# Altium project ui-v1.2.PrjPcb
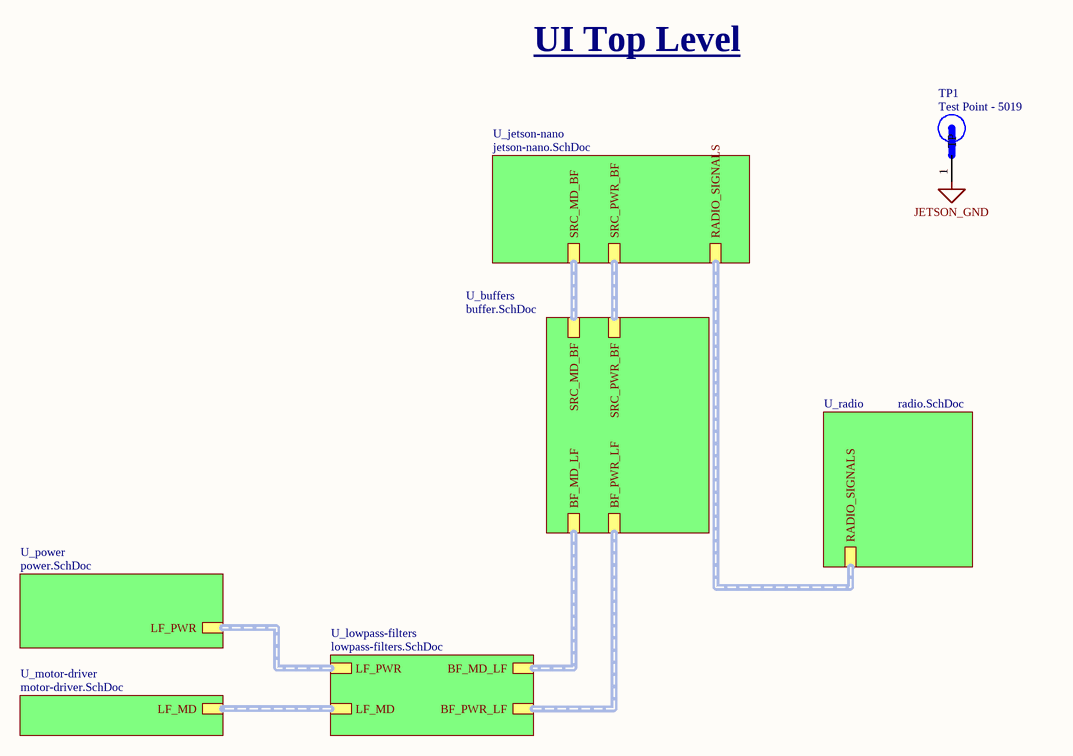
[diagram p0: ui-pcb.SchDoc]
7 sheets, 72 parts. Net scope: hierarchical (ports join the sheet entries above them; power ports are global).
Board file: ui_layout-v1.2.PcbDoc
Sheets:
  ui-pcb.SchDoc
    U_jetson-nano = jetson-nano.SchDoc
    U_lowpass-filters = lowpass-filters.SchDoc
    U_motor-driver = motor-driver.SchDoc
    U_power = power.SchDoc
    U_buffers = buffer.SchDoc
    U_radio = radio.SchDoc

## Sheet ui-pcb.SchDoc
size A4; SheetNumber: 1; SheetTotal: 8

### Parts
TP1  Test Point - 5019  [TP380X203]

### Sub-sheets
U_buffers = buffer.SchDoc: SRC_MD_BF (harness MD_SIGNALS), SRC_PWR_BF (harness PWR_SIGNALS), BF_MD_LF (harness MD_SIGNALS), BF_PWR_LF (harness PWR_SIGNALS)
U_jetson-nano = jetson-nano.SchDoc: SRC_PWR_BF (harness PWR_SIGNALS), SRC_MD_BF (harness MD_SIGNALS), RADIO_SIGNALS (harness RADIO_SIGNALS)
U_lowpass-filters = lowpass-filters.SchDoc: BF_PWR_LF (harness PWR_SIGNALS), LF_PWR (harness PWR_SIGNALS), BF_MD_LF (harness MD_SIGNALS), LF_MD (harness MD_SIGNALS)
U_motor-driver = motor-driver.SchDoc: LF_MD (harness MD_SIGNALS)
U_power = power.SchDoc: LF_PWR (harness PWR_SIGNALS)
U_radio = radio.SchDoc: RADIO_SIGNALS (harness RADIO_SIGNALS)

### Nets
JETSON_GND: TP1.1(TP)

### Buses and harness runs
harness sheet U_buffers/BF_MD_LF = sheet U_lowpass-filters/BF_MD_LF
harness sheet U_buffers/BF_PWR_LF = sheet U_lowpass-filters/BF_PWR_LF
harness sheet U_buffers/SRC_MD_BF = sheet U_jetson-nano/SRC_MD_BF
harness sheet U_buffers/SRC_PWR_BF = sheet U_jetson-nano/SRC_PWR_BF
harness sheet U_jetson-nano/RADIO_SIGNALS = sheet U_radio/RADIO_SIGNALS
harness sheet U_lowpass-filters/LF_MD = sheet U_motor-driver/LF_MD
harness sheet U_lowpass-filters/LF_PWR = sheet U_power/LF_PWR

### Notes on the sheet
- UI Top Level

### Library data of the parts
TP1 = Test Point - 5019: PC Test Point, Miniature Phosphor Bronze, Silver Plating Surface Mount Mounting Type; MP: 5019; MF: Keystone Electronics; Value: *; Package: 2010 Keystone; Part Number: Test Point - 5019

## Sheet jetson-nano.SchDoc
size A3
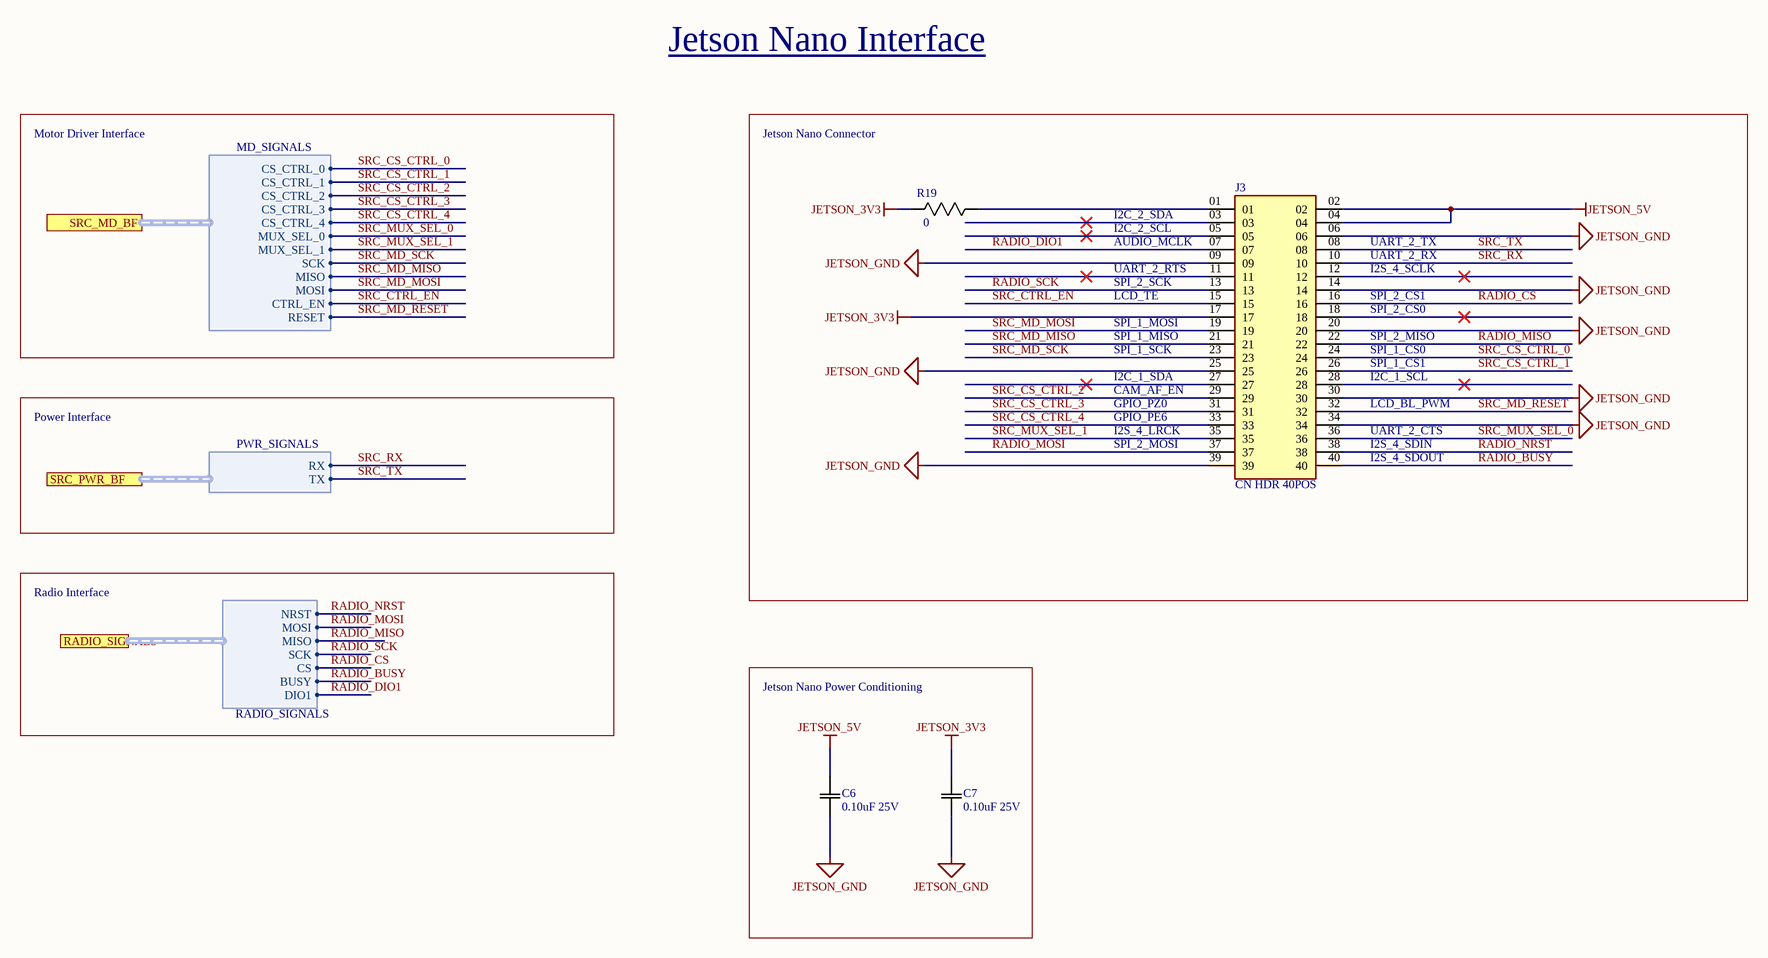
[diagram p1: jetson-nano.SchDoc]

### Parts
C6  0.10uF 25V  [0805]
C7  0.10uF 25V  [0805]
J3  CN HDR 40POS  [CN HDR 40POS 0.1 TH]
R19  0  [0603]

### Blocks framed on the sheet
Jetson Nano Power Conditioning: C6 C7

### Ports
RADIO_SIGNALS (harness RADIO_SIGNALS), SRC_MD_BF (harness MD_SIGNALS), SRC_PWR_BF (harness PWR_SIGNALS)

### Harnesses
PWR_SIGNALS: TX, RX
MD_SIGNALS: CS_CTRL_0, MUX_SEL_1, SCK, MOSI, MISO, CS_CTRL_1, CS_CTRL_2, CS_CTRL_3, CS_CTRL_4, MUX_SEL_0, CTRL_EN, RESET
RADIO_SIGNALS: CS, SCK, MISO, MOSI, NRST, BUSY, DIO1

### Nets
JETSON_3V3: C7.2(C2) J3.17 R19.2(R2)
JETSON_5V: C6.2(C2) J3.02 J3.04
JETSON_GND: C6.1(C1) C7.1(C1) J3.06 J3.09 J3.14 J3.20 J3.25 J3.30 J3.34 J3.39
RADIO_BUSY: J3.40 ; port RADIO_SIGNALS.BUSY
RADIO_CS: J3.16 ; port RADIO_SIGNALS.CS
RADIO_DIO1: J3.07 ; port RADIO_SIGNALS.DIO1
RADIO_MISO: J3.22 ; port RADIO_SIGNALS.MISO
RADIO_MOSI: J3.37 ; port RADIO_SIGNALS.MOSI
RADIO_NRST: J3.38 ; port RADIO_SIGNALS.NRST
RADIO_SCK: J3.13 ; port RADIO_SIGNALS.SCK
SRC_CS_CTRL_0: J3.24 ; port SRC_MD_BF.CS_CTRL_0
SRC_CS_CTRL_1: J3.26 ; port SRC_MD_BF.CS_CTRL_1
SRC_CS_CTRL_2: J3.29 ; port SRC_MD_BF.CS_CTRL_2
SRC_CS_CTRL_3: J3.31 ; port SRC_MD_BF.CS_CTRL_3
SRC_CS_CTRL_4: J3.33 ; port SRC_MD_BF.CS_CTRL_4
SRC_CTRL_EN: J3.15 ; port SRC_MD_BF.CTRL_EN
SRC_MD_MISO: J3.21 ; port SRC_MD_BF.MISO
SRC_MD_MOSI: J3.19 ; port SRC_MD_BF.MOSI
SRC_MD_RESET: J3.32 ; port SRC_MD_BF.RESET
SRC_MD_SCK: J3.23 ; port SRC_MD_BF.SCK
SRC_MUX_SEL_0: J3.36 ; port SRC_MD_BF.MUX_SEL_0
SRC_MUX_SEL_1: J3.35 ; port SRC_MD_BF.MUX_SEL_1
SRC_RX: J3.10 ; port SRC_PWR_BF.RX
SRC_TX: J3.08 ; port SRC_PWR_BF.TX
NetJ3_01: J3.01 R19.1(R1)

Not connected (* = marked no-connect by the designer): J3 03* 05* 11* 12* 18* 27* 28*

### Notes on the sheet
- Jetson Nano Interface
- Motor Driver Interface
- Jetson Nano Connector
- AUDIO_MCLK
- UART_2_RTS
- I2C_2_SDA
- I2C_2_SCL
- I2S_4_SCLK
- UART_2_TX
- UART_2_RX
- LCD_TE
- SPI_2_SCK
- SPI_1_MOSI
- SPI_1_MISO
- SPI_2_CS1
- SPI_2_MISO
- SPI_2_CS0
- GPIO_PZ0
- CAM_AF_EN
- SPI_1_SCK
- I2C_1_SDA
- LCD_BL_PWM
- SPI_1_CS0
- SPI_1_CS1
- I2C_1_SCL
- Power Interface
- SPI_2_MOSI
- I2S_4_LRCK
- GPIO_PE6
- I2S_4_SDIN
- UART_2_CTS
- I2S_4_SDOUT
- Radio Interface

### Library data of the parts
C6 C7 = CAP 0.10uF 25V: CAP CER 0.10UF 25V X7R 0805; Value: 0.1uF; Tolerance: 10%; Temperature Coefficient: X7R; Rating: 25V; Part Number: CAP 0.10uF 25V; Operating Temperature: -55°C ~ 125°C
J3 = CN HDR 40POS: 40 Position Header Connector; Part Number: CN HDR 40POS; Supplier 1: Digi-Key; Supplier Part Number 1: S6104-ND; Supplier URL 1: https://www.digikey.ca/en/products/detail/sullins-connector-solutions/PPTC202LFBN-RC/807240?s=N4IgTCBcDaIMoDYCMAGALAWgHIBEQF0BfIA; Pin Count: 40
R19 = RES 0 JUMPER 0603: Default Resistor Symbol; Power (Watts): 0.125W; Package: 0805; Tolerance: N/A; Value: 0; Part Number: RES 0 JUMPER 0603

## Sheet lowpass-filters.SchDoc
size A3; SheetNumber: 1; SheetTotal: 6
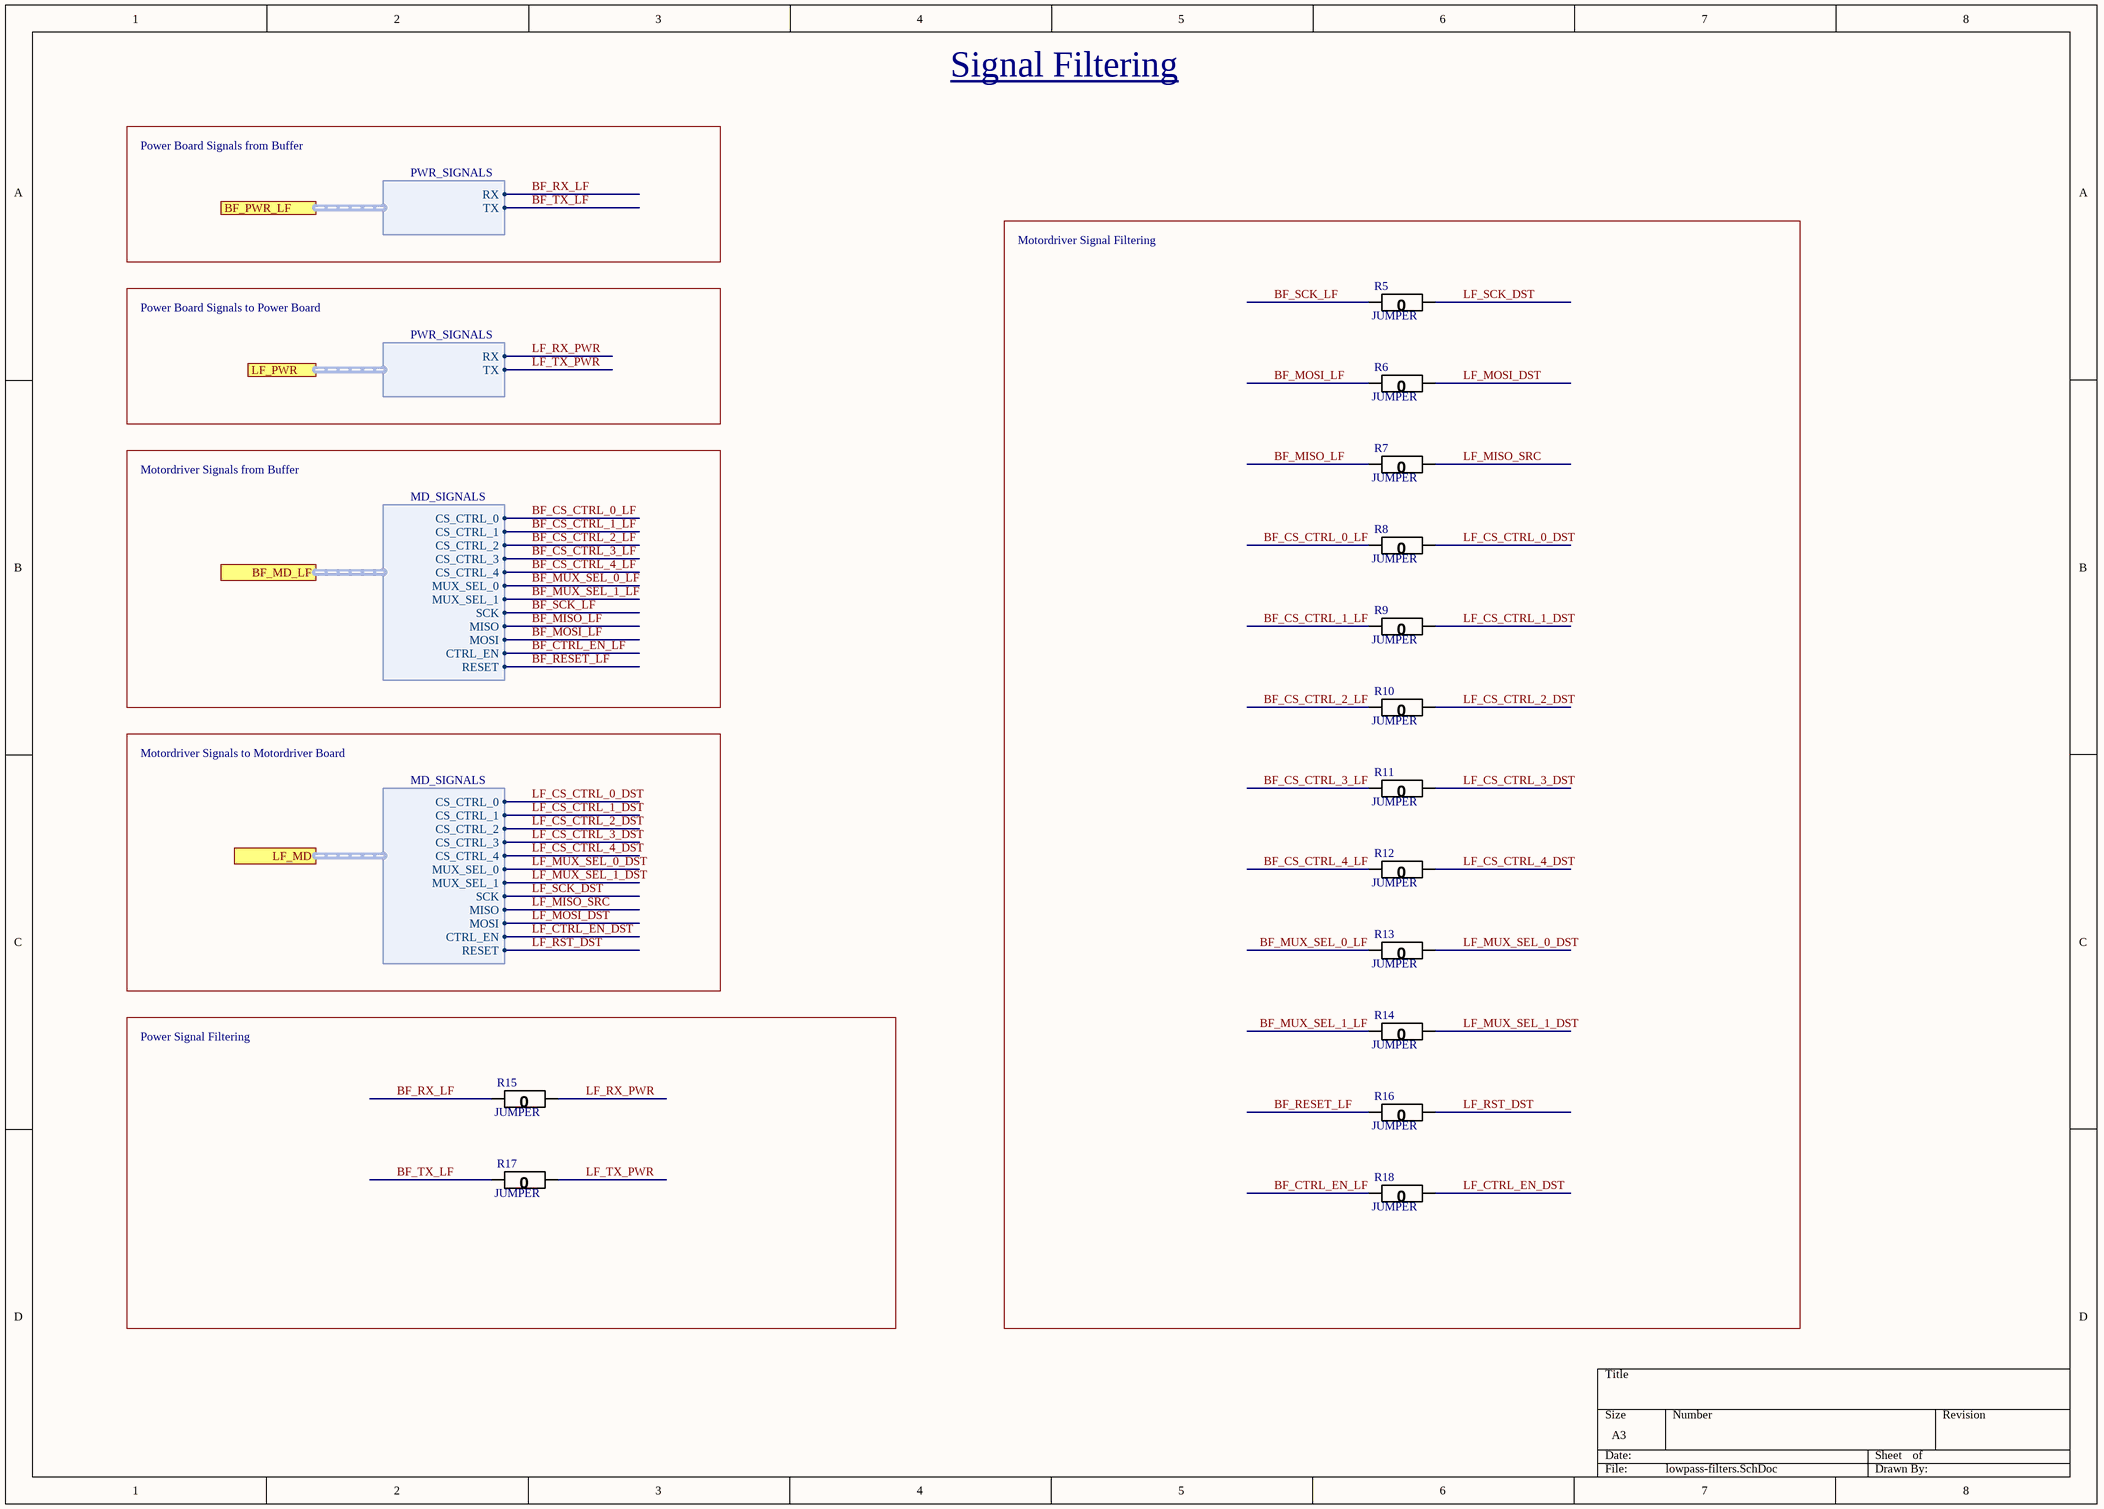
[diagram p2: lowpass-filters.SchDoc]

### Parts
R5  JUMPER  [0603]
R6  JUMPER  [0603]
R7  JUMPER  [0603]
R8  JUMPER  [0603]
R9  JUMPER  [0603]
R10  JUMPER  [0603]
R11  JUMPER  [0603]
R12  JUMPER  [0603]
R13  JUMPER  [0603]
R14  JUMPER  [0603]
R15  JUMPER  [0603]
R16  JUMPER  [0603]
R17  JUMPER  [0603]
R18  JUMPER  [0603]

### Blocks framed on the sheet
Motordriver Signal Filtering: R5-R14 R16 R18
Power Signal Filtering: R15 R17

### Ports
BF_MD_LF (harness MD_SIGNALS), BF_PWR_LF (harness PWR_SIGNALS), LF_MD (harness MD_SIGNALS), LF_PWR (harness PWR_SIGNALS)

### Harnesses
PWR_SIGNALS: TX, RX
MD_SIGNALS: CS_CTRL_0, MUX_SEL_1, SCK, MOSI, MISO, CS_CTRL_1, CS_CTRL_2, CS_CTRL_3, CS_CTRL_4, MUX_SEL_0, CTRL_EN, RESET

### Nets
BF_CS_CTRL_0_LF: R8.2(R2) ; port BF_MD_LF.CS_CTRL_0  [project net BF_CS_CTRL_0]
BF_CS_CTRL_1_LF: R9.2(R2) ; port BF_MD_LF.CS_CTRL_1  [project net BF_CS_CTRL_1]
BF_CS_CTRL_2_LF: R10.2(R2) ; port BF_MD_LF.CS_CTRL_2  [project net BF_CS_CTRL_2]
BF_CS_CTRL_3_LF: R11.2(R2) ; port BF_MD_LF.CS_CTRL_3  [project net BF_CS_CTRL_3]
BF_CS_CTRL_4_LF: R12.2(R2) ; port BF_MD_LF.CS_CTRL_4  [project net BF_CS_CTRL_4]
BF_CTRL_EN_LF: R18.2(R2) ; port BF_MD_LF.CTRL_EN  [project net BF_CTRL_EN]
BF_MISO_LF: R7.2(R2) ; port BF_MD_LF.MISO  [project net BF_MISO]
BF_MOSI_LF: R6.2(R2) ; port BF_MD_LF.MOSI  [project net BF_MOSI]
BF_MUX_SEL_0_LF: R13.2(R2) ; port BF_MD_LF.MUX_SEL_0  [project net BF_MUX_SEL_0]
BF_MUX_SEL_1_LF: R14.2(R2) ; port BF_MD_LF.MUX_SEL_1  [project net BF_MUX_SEL_1]
BF_RESET_LF: R16.2(R2) ; port BF_MD_LF.RESET  [project net BF_RESET]
BF_RX_LF: R15.2(R2) ; port BF_PWR_LF.RX  [project net BF_RX]
BF_SCK_LF: R5.2(R2) ; port BF_MD_LF.SCK  [project net BF_SCK]
BF_TX_LF: R17.2(R2) ; port BF_PWR_LF.TX  [project net BF_TX]
LF_CS_CTRL_0_DST: R8.1(R1) ; port LF_MD.CS_CTRL_0  [project net CS_CTRL_0]
LF_CS_CTRL_1_DST: R9.1(R1) ; port LF_MD.CS_CTRL_1  [project net CS_CTRL_1]
LF_CS_CTRL_2_DST: R10.1(R1) ; port LF_MD.CS_CTRL_2  [project net CS_CTRL_2]
LF_CS_CTRL_3_DST: R11.1(R1) ; port LF_MD.CS_CTRL_3  [project net CS_CTRL_3]
LF_CS_CTRL_4_DST: R12.1(R1) ; port LF_MD.CS_CTRL_4  [project net CS_CTRL_4]
LF_CTRL_EN_DST: R18.1(R1) ; port LF_MD.CTRL_EN  [project net CTRL_EN]
LF_MISO_SRC: R7.1(R1) ; port LF_MD.MISO
LF_MOSI_DST: R6.1(R1) ; port LF_MD.MOSI
LF_MUX_SEL_0_DST: R13.1(R1) ; port LF_MD.MUX_SEL_0
LF_MUX_SEL_1_DST: R14.1(R1) ; port LF_MD.MUX_SEL_1
LF_RST_DST: R16.1(R1) ; port LF_MD.RESET
LF_RX_PWR: R15.1(R1) ; port LF_PWR.RX
LF_SCK_DST: R5.1(R1) ; port LF_MD.SCK
LF_TX_PWR: R17.1(R1) ; port LF_PWR.TX

### Notes on the sheet
- Signal Filtering
- Power Board Signals from Buffer
- Power Board Signals to Power Board
- Motordriver Signals from Buffer
- Motordriver Signals to Motordriver Board

### Library data of the parts
R5-R18 = RES 0 JUMPER: RES SMD 0 OHM JUMPER GENERIC 0603; Manufacturer Part Number 1: RK73Z1JTTD; Value: 0; Package: 0805; Part Number: RES 0 JUMPER; Tolerance: N/A; Supplier 1: Digi-Key; Supplier Part Number 1: 2019-RK73Z1JTTDCT-ND; Supplier URL 1: https://www.digikey.ca/en/products/detail/koa-speer-electronics-inc/RK73Z1JTTD/9845478

## Sheet motor-driver.SchDoc
size A
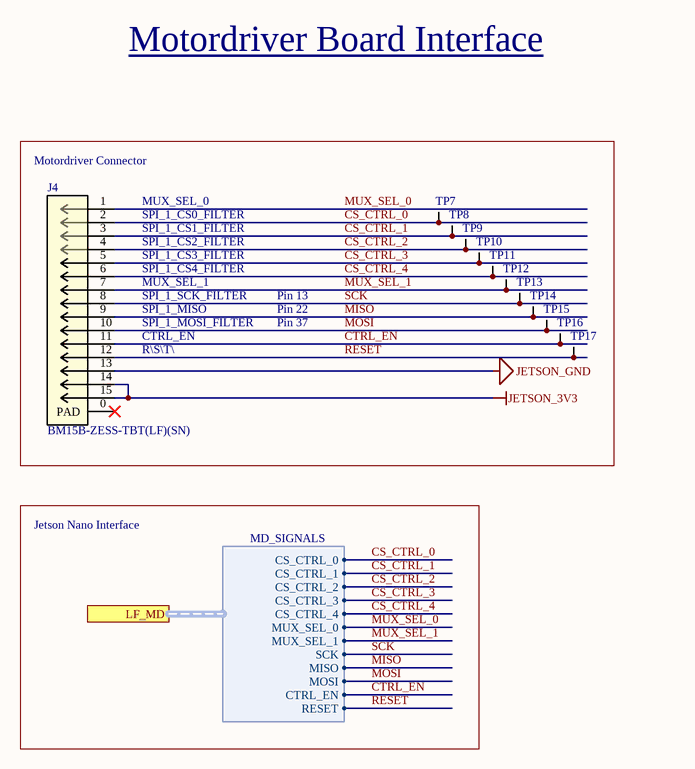
[diagram p3: motor-driver.SchDoc]

### Parts
J4  BM15B-ZESS-TBT(LF)(SN)  [JST ZE SMT 15POS]
TP7  Test Point (Via)  [TP]  (value not drawn)  (no BOM)
TP8  Test Point (Via)  [TP]  (value not drawn)  (no BOM)
TP9  Test Point (Via)  [TP]  (value not drawn)  (no BOM)
TP10  Test Point (Via)  [TP]  (value not drawn)  (no BOM)
TP11  Test Point (Via)  [TP]  (value not drawn)  (no BOM)
TP12  Test Point (Via)  [TP]  (value not drawn)  (no BOM)
TP13  Test Point (Via)  [TP]  (value not drawn)  (no BOM)
TP14  Test Point (Via)  [TP]  (value not drawn)  (no BOM)
TP15  Test Point (Via)  [TP]  (value not drawn)  (no BOM)
TP16  Test Point (Via)  [TP]  (value not drawn)  (no BOM)
TP17  Test Point (Via)  [TP]  (value not drawn)  (no BOM)

### Ports
LF_MD (harness MD_SIGNALS)

### Harnesses
MD_SIGNALS: CS_CTRL_0, MUX_SEL_1, SCK, MOSI, MISO, CS_CTRL_1, CS_CTRL_2, CS_CTRL_3, CS_CTRL_4, MUX_SEL_0, CTRL_EN, RESET

### Nets
JETSON_3V3: J4.14 J4.15
JETSON_GND: J4.13
CS_CTRL_0: J4.2 TP7.1 ; port LF_MD.CS_CTRL_0
CS_CTRL_1: J4.3 TP8.1 ; port LF_MD.CS_CTRL_1
CS_CTRL_2: J4.4 TP9.1 ; port LF_MD.CS_CTRL_2
CS_CTRL_3: J4.5 TP10.1 ; port LF_MD.CS_CTRL_3
CS_CTRL_4: J4.6 TP11.1 ; port LF_MD.CS_CTRL_4
CTRL_EN: J4.11 TP16.1 ; port LF_MD.CTRL_EN
MISO: J4.9 TP14.1 ; port LF_MD.MISO  [project net LF_MISO_SRC]
MOSI: J4.10 TP15.1 ; port LF_MD.MOSI  [project net LF_MOSI_DST]
MUX_SEL_0: J4.1 ; port LF_MD.MUX_SEL_0  [project net LF_MUX_SEL_0_DST]
MUX_SEL_1: J4.7 TP12.1 ; port LF_MD.MUX_SEL_1  [project net LF_MUX_SEL_1_DST]
RESET: J4.12 TP17.1 ; port LF_MD.RESET  [project net LF_RST_DST]
SCK: J4.8 TP13.1 ; port LF_MD.SCK  [project net LF_SCK_DST]

Not connected (* = marked no-connect by the designer): J4 0(PAD)*

### Notes on the sheet
- Motordriver Board Interface
- (near J4) Motordriver Connector
- MUX_SEL_0
- SPI_1_CS0_FILTER
- SPI_1_CS1_FILTER
- SPI_1_CS2_FILTER
- SPI_1_CS3_FILTER
- SPI_1_CS4_FILTER
- CTRL_EN
- SPI_1_SCK_FILTER
- SPI_1_MISO
- SPI_1_MOSI_FILTER
- MUX_SEL_1
- Pin 37
- Pin 22
- Pin 13
- R\S\T\
- Jetson Nano Interface

### Library data of the parts
J4 = CN 15POS JST ZE SMT: CONN HEADER VERT SMD 15POS ZE; Supplier 1: Digi-Key; Supplier Part Number 1: 455-4211-1-ND; Part Number: CN 15POS JST ZE SMT; Manufacturer Part Number 1: BM15B-ZESS-TBT(LF)(SN); Supplier URL 1: https://www.digikey.ca/en/products/detail/jst-sales-america-inc/BM15B-ZESS-TBT-LF-SN/1886999?s=N4IgTCBcDaIEIFkCMBWOBaAWgUQMq-QBU5CAKAGQDEBKU3AOWpAF0BfIA; Pin Count: 15
TP7-TP17 = Test Point (Via): Part Number: Test Point (Via)

## Sheet power.SchDoc
size A4; SheetNumber: 3; SheetTotal: 4
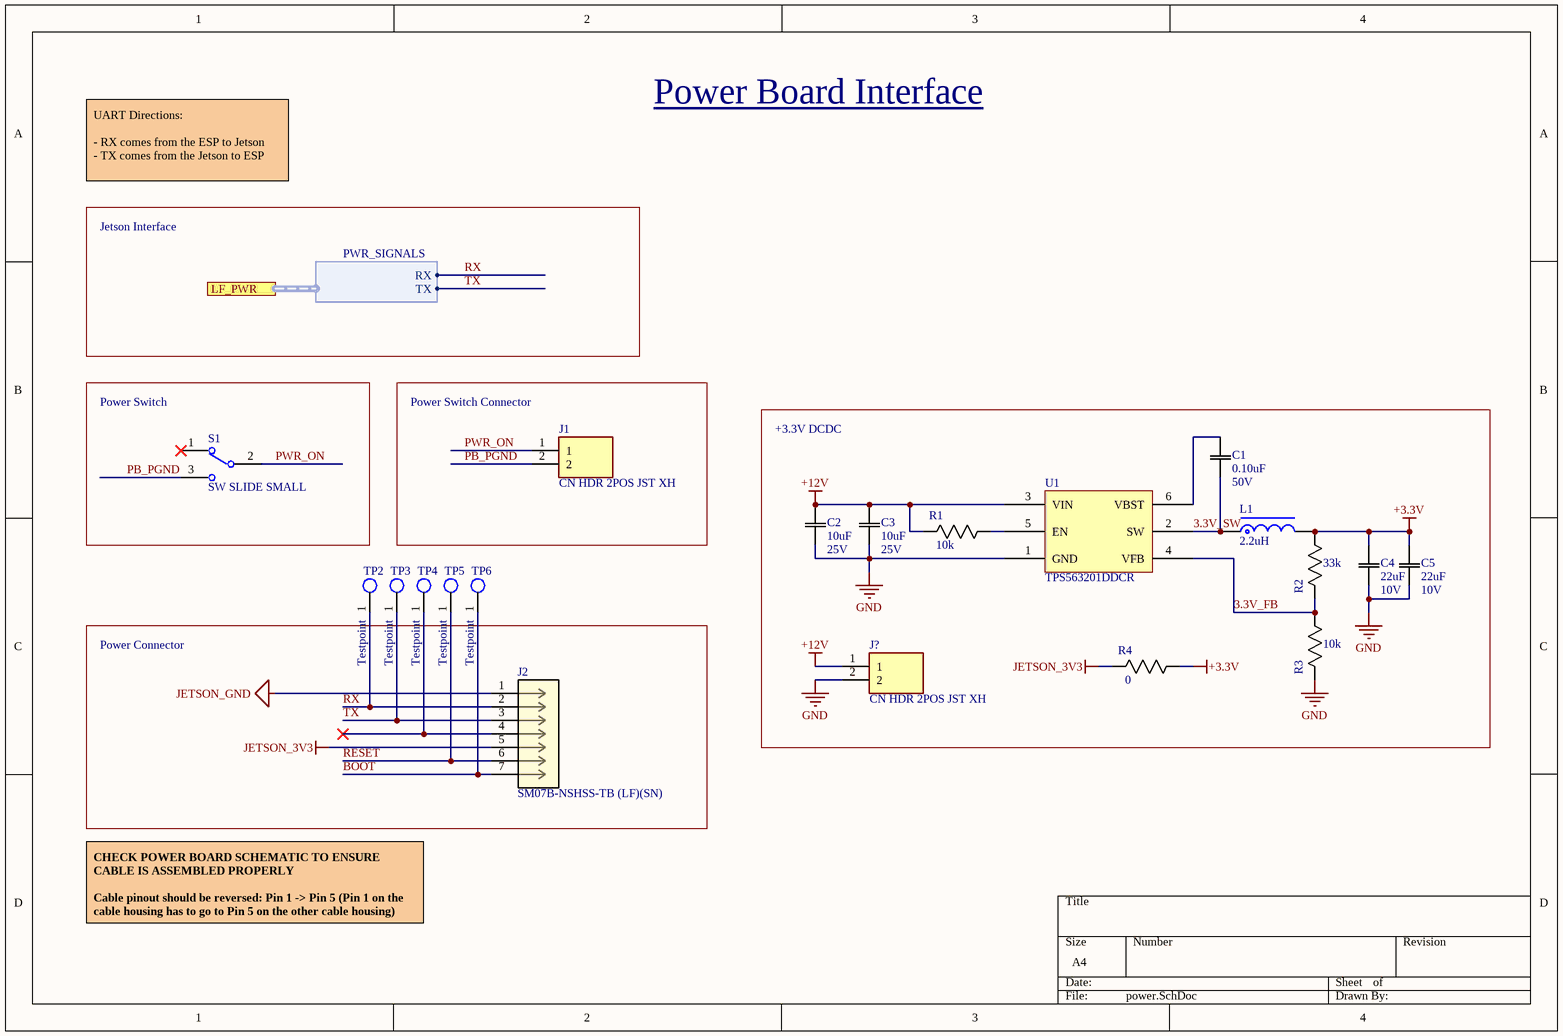
[diagram p4: power.SchDoc]

### Parts
C1  Rating: 50V  [0603]  (hidden comment: 0.10uF)
C2  Rating: 25V  [1206]  (hidden comment: 10uF)
C3  Rating: 25V  [1206]  (hidden comment: 10uF)
C4  Rating: 10V  [0805]  (hidden comment: 22uF)
C5  Rating: 10V  [0805]  (hidden comment: 22uF)
J1  CN HDR 2POS JST XH  [JST_B2B-XH-A(LF)(SN)]
J2  SM07B-NSHSS-TB (LF)(SN)  [JST_SM07B-NSHSS-TB_(LF)(SN)]
J?  CN HDR 2POS JST XH  [JST_B2B-XH-A(LF)(SN)]
L1  2.2uH  [L-SMD-0420]
R1  10k  [0603]
R2  33k  [0603]
R3  10k  [0603]
R4  0  [0603]
S1  SW SLIDE SMALL  [SW SLIDE SMALL]
TP2  Testpoint  [TP_1mm]
TP3  Testpoint  [TP_1mm]
TP4  Testpoint  [TP_1mm]
TP5  Testpoint  [TP_1mm]
TP6  Testpoint  [TP_1mm]
U1  TPS563201DDCR  [TSOT-23-6]

### Blocks framed on the sheet
Power Switch: S1
Power Switch Connector: J1
+3.3V DCDC: C1-C5 J? L1 R1-R4 U1
Power Connector: J2

### Ports
LF_PWR (harness PWR_SIGNALS)

### Harnesses
PWR_SIGNALS: TX, RX

### Nets
+3.3V: C4.2(C2) C5.2(C2) L1.2 R2.1(R1) R4.1(R1)
+12V: C2.2(C2) C3.2(C2) J?.1 R1.2(R2) U1.3(VIN)
GND: C2.1(C1) C3.1(C1) C4.1(C1) C5.1(C1) J?.2 R3.2(R2) U1.1(GND)
JETSON_3V3: J2.5 R4.2(R2)
JETSON_GND: J2.1
3.3V_FB: R2.2(R2) R3.1(R1) U1.4(VFB)
3.3V_SW: C1.1(C1) L1.1 U1.2(SW)
BOOT: J2.7 TP6.1(TP)
PB_PGND: J1.2 S1.3
PWR_ON: J1.1 S1.2
RESET: J2.6 TP5.1(TP)
RX: J2.2 TP2.1(TP) ; port LF_PWR.RX  [project net LF_RX_PWR]
TX: J2.3 TP3.1(TP) ; port LF_PWR.TX  [project net LF_TX_PWR]
NetC1_2: C1.2(C2) U1.6(VBST)
NetJ2_4: J2.4 TP4.1(TP)
NetR1_1: R1.1(R1) U1.5(EN)

Not connected (* = marked no-connect by the designer): S1 1*

### Notes on the sheet
- Power Board Interface
- UART Directions:
  - RX comes from the ESP to Jetson
  - TX comes from the Jetson to ESP
- Jetson Interface
- CHECK POWER BOARD SCHEMATIC TO ENSURE CABLE IS ASSEMBLED PROPERLY
  Cable pinout should be reversed: Pin 1 -> Pin 5 (Pin 1 on the cable housing has to go to Pin 5 on the other cable housing)

### Library data of the parts
C1 = CAP 0.1uF 50V: Default Symbol for Capacitors; Temperature Coefficient: X7R; Tolerance: 10%; Value: 0.10uF; Part Number: CAP 0.1uF 50V
C2 C3 = CAP 10uF 25V: Default Symbol for Capacitors; Temperature Coefficient: X5R; Tolerance: 10%; Value: 10uF; Part Number: CAP 10uF 25V
C4 C5 = CAP 22uF 10V: Default Symbol for Capacitors; Temperature Coefficient: X5R; Tolerance: 20%; Value: 22uF; Part Number: CAP 22uF 10V
J1 J? = CN HDR 2POS JST XH: Connector Header Through Hole 2 position 0.098 _2.50mm_ / JST XH; MP: B2B-XH-A_LF__SN_; MF: JST Sales; Price: None; Package: None; Value: *; SnapEDA_Link: https://www.snapeda.com/parts/B2B-XH-A%28LF%29%28SN%29/JST%20Sales%20America%20Inc./view-part/492310/?ref=snap; Part Number: CN HDR 2POS JST XH; Pin Count: 2
J2 = CN 7POS JST NSH SMT RA: Connector Header Surface Mount, Right Angle 7 position 0.039" (1.00mm); MP: SM12B-NSHSS-TB (LF)(SN); MF: JST Sales America Inc.; Package: None; Check_prices: https://www.snapeda.com/parts/SM12B-NSHSS-TB%20(LF)(SN)/JST%20Sales%20America%20Inc./view-part/5255521/?ref=eda; Value: *; Availability: Unavailable; Price: None; SnapEDA_Link: https://www.snapeda.com/parts/SM12B-NSHSS-TB%20(LF)(SN)/JST%20Sales%20America%20Inc./view-part/5255521/?ref=snap; Supplier 1: Digi-Key; Supplier 2: Digi-Key; Supplier 3: Digi-Key; Supplier 4: Digi-Key; Supplier Part Number 1: 455-2771-1-ND; Supplier Part Number 2: 455-2771-1-ND; Supplier Part Number 3: 455-2771-6-ND; Supplier Part Number 4: 455-2771-2-ND; Part Number: CN 7POS JST NSH SMT RA; Supplier URL 1: https://www.digikey.ca/en/products/detail/jst-sales-america-inc/SM07B-NSHSS-TB-LF-SN/3313637; Pin Count: 7
L1 = IND 2.2uH 3A 0420: Standard inductor symbol; Part Number: IND 2.2uH 3A 0420; Value: 2.2uH
R1 R3 = RES 10k 1/8W - 1%: Default Resistor Symbol; Manufacturer Part Number 1: ERJ-H3GJ103V; Power (Watts): 0.125W; Tolerance: 5%; Package: 0805; Value: 10k; Part Number: RES 10k 1/8W - 1%; Supplier 1: Digi-Key; Supplier Part Number 1: 10-ERJ-H3GJ103VCT-ND; Supplier URL 1: https://www.digikey.ca/en/products/detail/panasonic-electronic-components/ERJ-H3GJ103V/13877876?s=N4IgTCBcDaIIwAYC0BRASgKSQCQMwHENFcA1AYQBUkA5AERAF0BfIA; Manufacturer Part Number 2: RMCF0805JT10K0; Supplier 2: Digi-Key; Supplier Part Number 2: RMCF0805JT10K0CT-ND; Supplier URL 2: https://www.digikey.ca/en/products/detail/stackpole-electronics-inc/RMCF0805JT10K0/1757762?s=N4IgTCBcDaIEoFkDCAxADADjQVgFIBUBGNAaTSXxAF0BfIA; Tolerance 2: 5%
R2 = RES 33k 1/8W: Default Resistor Symbol; Power (Watts): 0.125W; Tolerance: 5%; Package: 0805; Value: 33k; Part Number: RES 33k 1/8W
R4 = RES 0 JUMPER 0603: as R19 on sheet jetson-nano; Package: 0805; Tolerance: N/A; Value: 0; Part Number: RES 0 JUMPER 0603
S1 = SW SLIDE SMALL: Slide Switch SPDT Surface Mount, Right Angle; Manufacturer Part Number 1: JS102011SAQN SPDT; MF: C&K; MP: JS102011SAQN; Availability: Unavailable; Price: None; SnapEDA_Link: https://www.snapeda.com/parts/JS102011SAQN/C%26K/view-part/214325/?ref=snap; Value: *; Package: None; Part Number: SW SLIDE SMALL; Supplier 1: Digi-key; Supplier Part Number 1: JS102011SAQN SPDT; Supplier URL 1: https://www.digikey.ca/en/products/detail/c-k/JS102011SAQN/1640095
TP2-TP6 = TP_1MM: Part Number: TP_1MM
U1 = TPS563201DDCR: 17 V Input, 3A Synchronous Step-Down Regulator in SOT-23 with Advanced Eco-mode™; Part Number: TPS563201DDCR

## Sheet buffer.SchDoc
size A3
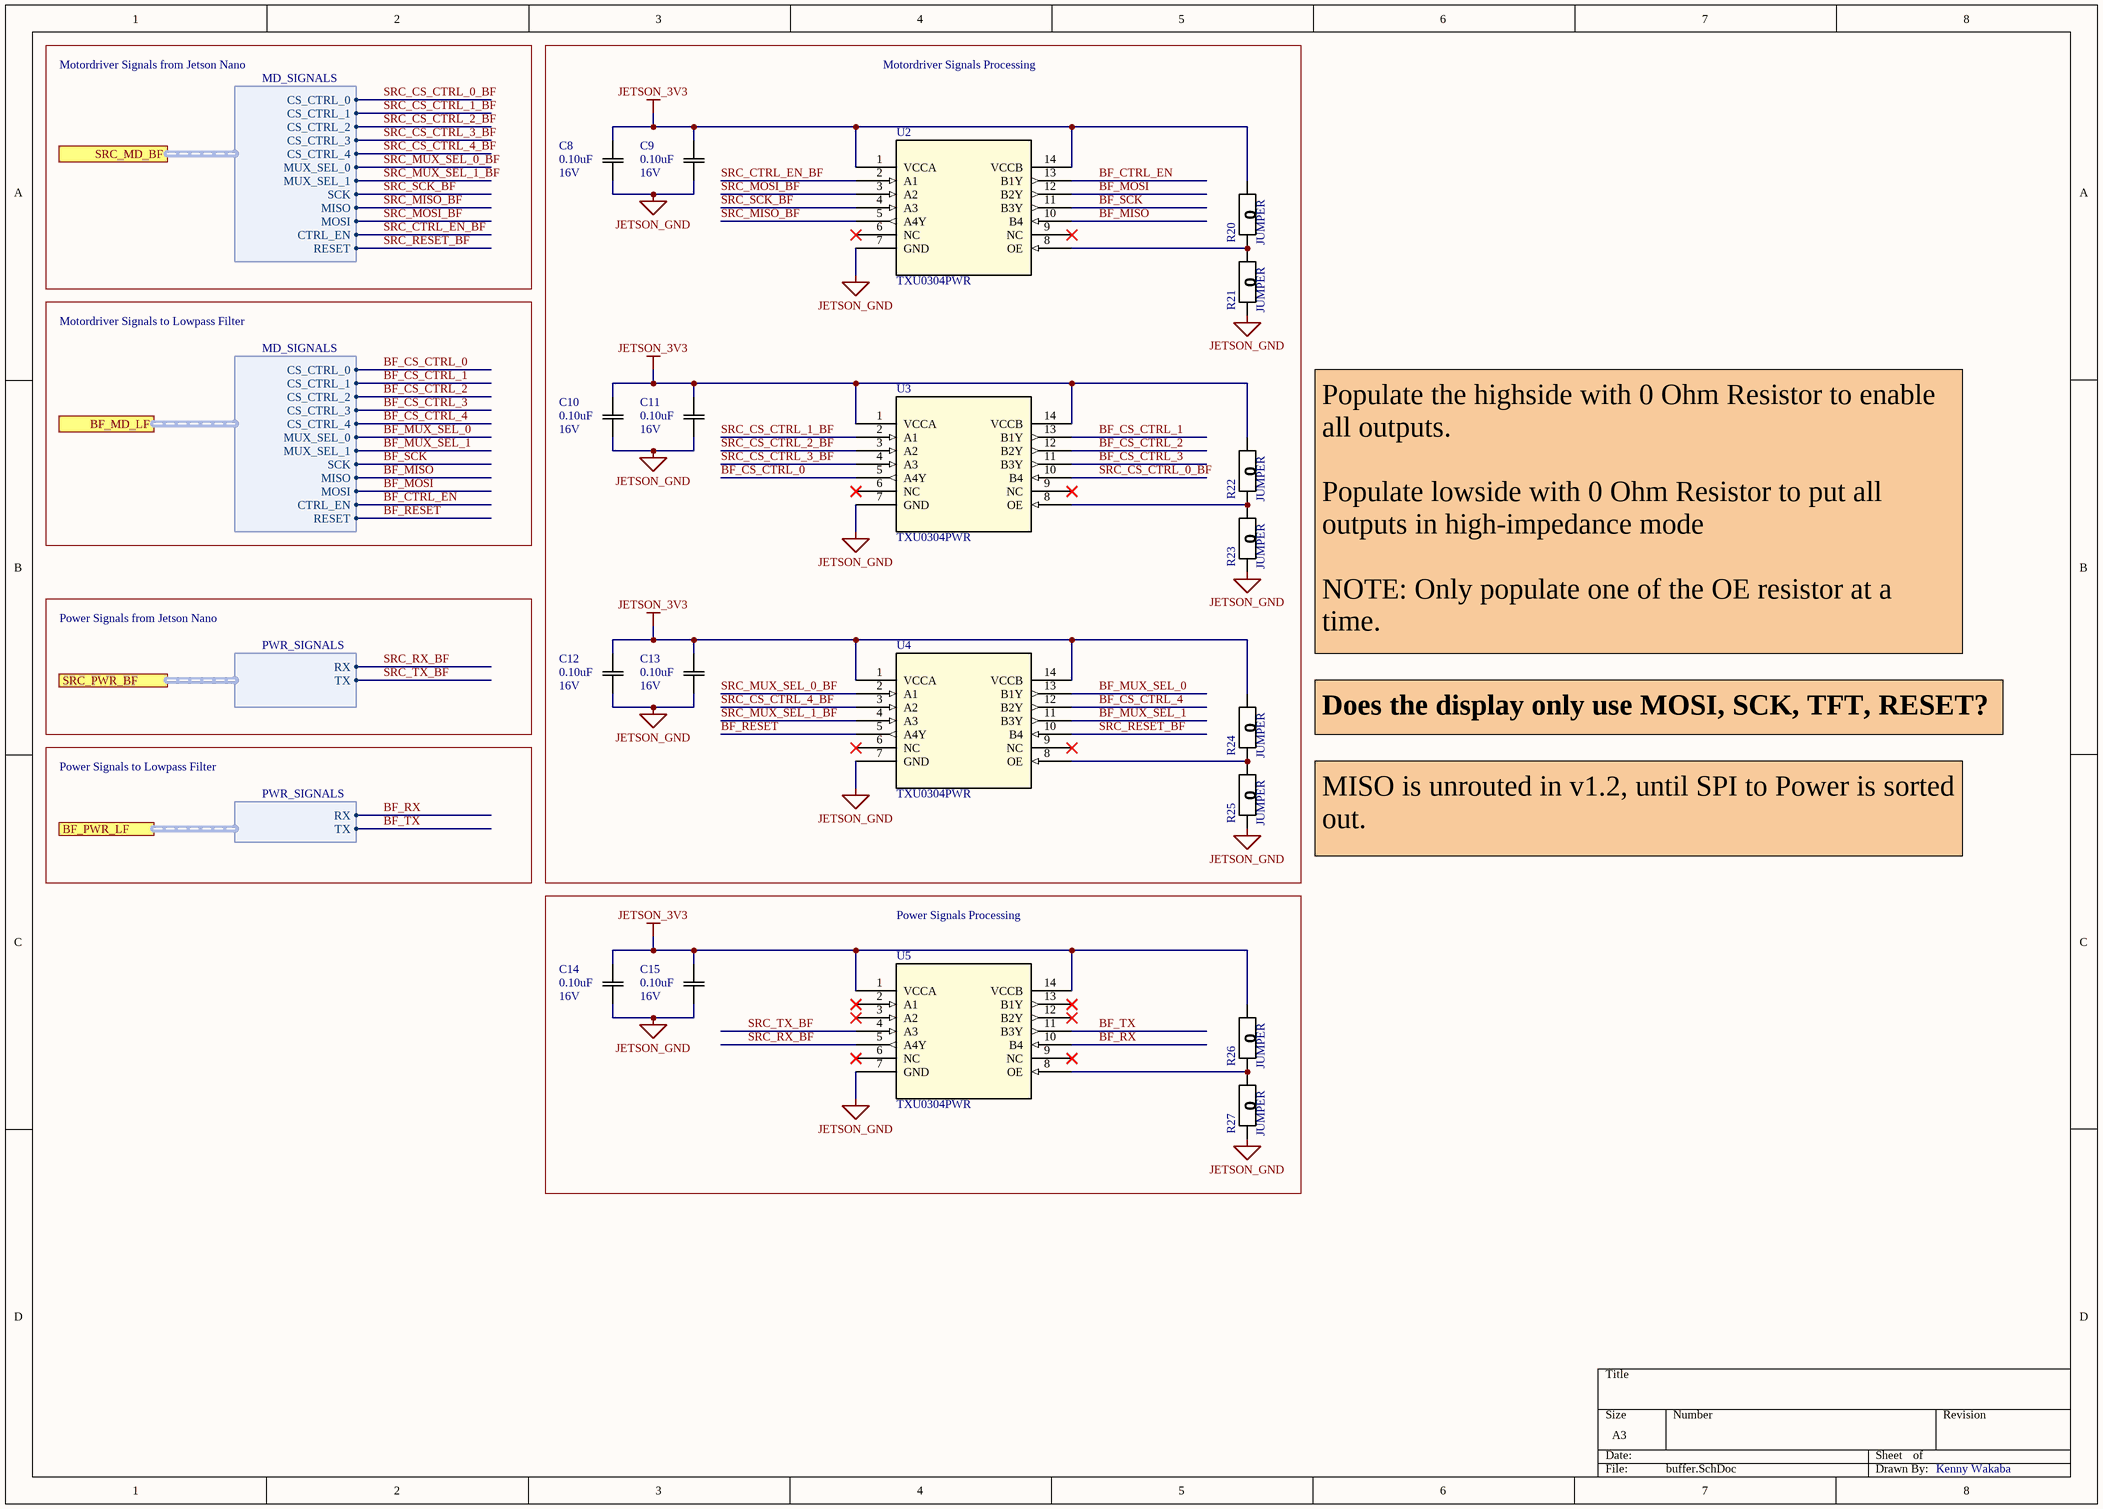
[diagram p5: buffer.SchDoc]

### Parts
C8  Rating: 16V  [0603]  (hidden comment: 0.10uF)
C9  Rating: 16V  [0603]  (hidden comment: 0.10uF)
C10  Rating: 16V  [0603]  (hidden comment: 0.10uF)
C11  Rating: 16V  [0603]  (hidden comment: 0.10uF)
C12  Rating: 16V  [0603]  (hidden comment: 0.10uF)
C13  Rating: 16V  [0603]  (hidden comment: 0.10uF)
C14  Rating: 16V  [0603]  (hidden comment: 0.10uF)
C15  Rating: 16V  [0603]  (hidden comment: 0.10uF)
R20  JUMPER  [0603]
R21  JUMPER  [0603]
R22  JUMPER  [0603]
R23  JUMPER  [0603]
R24  JUMPER  [0603]
R25  JUMPER  [0603]
R26  JUMPER  [0603]
R27  JUMPER  [0603]
U2  TXU0304PWR  [14-TSSOP]
U3  TXU0304PWR  [14-TSSOP]
U4  TXU0304PWR  [14-TSSOP]
U5  TXU0304PWR  [14-TSSOP]

### Blocks framed on the sheet
Motordriver Signals Processing: C8-C13 R20-R25 U2-U4
Power Signals Processing: C14 C15 R26 R27 U5

### Ports
BF_MD_LF (harness MD_SIGNALS), BF_PWR_LF (harness PWR_SIGNALS), SRC_MD_BF (harness MD_SIGNALS), SRC_PWR_BF (harness PWR_SIGNALS)

### Harnesses
PWR_SIGNALS: TX, RX
MD_SIGNALS: CS_CTRL_0, MUX_SEL_1, SCK, MOSI, MISO, CS_CTRL_1, CS_CTRL_2, CS_CTRL_3, CS_CTRL_4, MUX_SEL_0, CTRL_EN, RESET

### Nets
JETSON_3V3: C8.1(C1) C9.1(C1) C10.1(C1) C11.1(C1) C12.1(C1) C13.1(C1) C14.1(C1) C15.1(C1) R20.1(R1) R22.1(R1) R24.1(R1) R26.1(R1) U2.1(VCCA) U2.14(VCCB) U3.1(VCCA) U3.14(VCCB) U4.1(VCCA) U4.14(VCCB) U5.1(VCCA) U5.14(VCCB)
JETSON_GND: C8.2(C2) C9.2(C2) C10.2(C2) C11.2(C2) C12.2(C2) C13.2(C2) C14.2(C2) C15.2(C2) R21.2(R2) R23.2(R2) R25.2(R2) R27.2(R2) U2.7(GND) U3.7(GND) U4.7(GND) U5.7(GND)
BF_CS_CTRL_0: U3.5(A4Y) ; port BF_MD_LF.CS_CTRL_0
BF_CS_CTRL_1: U3.13(B1Y) ; port BF_MD_LF.CS_CTRL_1
BF_CS_CTRL_2: U3.12(B2Y) ; port BF_MD_LF.CS_CTRL_2
BF_CS_CTRL_3: U3.11(B3Y) ; port BF_MD_LF.CS_CTRL_3
BF_CS_CTRL_4: U4.12(B2Y) ; port BF_MD_LF.CS_CTRL_4
BF_CTRL_EN: U2.13(B1Y) ; port BF_MD_LF.CTRL_EN
BF_MISO: U2.10(B4) ; port BF_MD_LF.MISO
BF_MOSI: U2.12(B2Y) ; port BF_MD_LF.MOSI
BF_MUX_SEL_0: U4.13(B1Y) ; port BF_MD_LF.MUX_SEL_0
BF_MUX_SEL_1: U4.11(B3Y) ; port BF_MD_LF.MUX_SEL_1
BF_RESET: U4.5(A4Y) ; port BF_MD_LF.RESET
BF_RX: U5.10(B4) ; port BF_PWR_LF.RX
BF_SCK: U2.11(B3Y) ; port BF_MD_LF.SCK
BF_TX: U5.11(B3Y) ; port BF_PWR_LF.TX
SRC_CS_CTRL_0_BF: U3.10(B4) ; port SRC_MD_BF.CS_CTRL_0  [project net SRC_CS_CTRL_0]
SRC_CS_CTRL_1_BF: U3.2(A1) ; port SRC_MD_BF.CS_CTRL_1  [project net SRC_CS_CTRL_1]
SRC_CS_CTRL_2_BF: U3.3(A2) ; port SRC_MD_BF.CS_CTRL_2  [project net SRC_CS_CTRL_2]
SRC_CS_CTRL_3_BF: U3.4(A3) ; port SRC_MD_BF.CS_CTRL_3  [project net SRC_CS_CTRL_3]
SRC_CS_CTRL_4_BF: U4.3(A2) ; port SRC_MD_BF.CS_CTRL_4  [project net SRC_CS_CTRL_4]
SRC_CTRL_EN_BF: U2.2(A1) ; port SRC_MD_BF.CTRL_EN  [project net SRC_CTRL_EN]
SRC_MISO_BF: U2.5(A4Y) ; port SRC_MD_BF.MISO  [project net SRC_MD_MISO]
SRC_MOSI_BF: U2.3(A2) ; port SRC_MD_BF.MOSI  [project net SRC_MD_MOSI]
SRC_MUX_SEL_0_BF: U4.2(A1) ; port SRC_MD_BF.MUX_SEL_0  [project net SRC_MUX_SEL_0]
SRC_MUX_SEL_1_BF: U4.4(A3) ; port SRC_MD_BF.MUX_SEL_1  [project net SRC_MUX_SEL_1]
SRC_RESET_BF: U4.10(B4) ; port SRC_MD_BF.RESET  [project net SRC_MD_RESET]
SRC_RX_BF: U5.5(A4Y) ; port SRC_PWR_BF.RX  [project net SRC_RX]
SRC_SCK_BF: U2.4(A3) ; port SRC_MD_BF.SCK  [project net SRC_MD_SCK]
SRC_TX_BF: U5.4(A3) ; port SRC_PWR_BF.TX  [project net SRC_TX]
NetR20_2: R20.2(R2) R21.1(R1) U2.8(OE)
NetR22_2: R22.2(R2) R23.1(R1) U3.8(OE)
NetR24_2: R24.2(R2) R25.1(R1) U4.8(OE)
NetR26_2: R26.2(R2) R27.1(R1) U5.8(OE)

Not connected (* = marked no-connect by the designer): U2 6(NC)* 9(NC)*; U3 6(NC)* 9(NC)*; U4 6(NC)* 9(NC)*; U5 2(A1)* 3(A2)* 6(NC)* 9(NC)* 12(B2Y)* 13(B1Y)*

### Notes on the sheet
- Motordriver Signals from Jetson Nano
- Motordriver Signals to Lowpass Filter
- Power Signals from Jetson Nano
- Populate the highside with 0 Ohm Resistor to enable all outputs.
  Populate lowside with 0 Ohm Resistor to put all outputs in high-impedance mode
  NOTE: Only populate one of the OE resistor at a time.
- Power Signals to Lowpass Filter
- Does the display only use MOSI, SCK, TFT, RESET?
- MISO is unrouted in v1.2, until SPI to Power is sorted out.
- Kenny Wakaba

### Library data of the parts
C8-C15 = CAP 0.10uF 16V: CAP CER 0.10UF 16V X5R 0603; Tolerance: 10%; Package: 0603/0805; Temperature Coefficient: X5R; Operating Temperature: -55°C ~ 85°C; Value: 0.10uF; Part Number: CAP 0.10uF 16V
R20-R27 = RES 0 JUMPER: as R5 on sheet lowpass-filters; Package: 0805; Part Number: RES 0 JUMPER; Tolerance: N/A; Supplier 1: Digi-Key; Supplier Part Number 1: 2019-RK73Z1JTTDCT-ND; Supplier URL 1: https://www.digikey.ca/en/products/detail/koa-speer-electronics-inc/RK73Z1JTTD/9845478
U2-U5 = TXU0304: 4-Bit Fixed Direction Voltage-Level Translator with Schmitt-Trigger Inputs  and 3-State Outputs; Mfr_Name: Texas Instruments; Copyright: Copyright (C) 2022 Ultra Librarian. All rights reserved.; Manufacturer_Part_Number: TXU0304PWR; Digi-Key_Part_Number_1: 296-TXU0304PWRTR-ND; Digi-Key_Part_Number_2: 296-TXU0304PWRCT-ND; Digi-Key_Part_Number_3: 296-TXU0304PWRDKR-ND; RefDes: RefDes; Type: DEV; Part Number: TXU0304; Supplier 1: Digi-Key; Supplier Part Number 1: 296-TXU0304PWRTR-ND; Supplier URL 1: https://www.digikey.ca/en/products/detail/texas-instruments/TXU0304PWR/14641423

## Sheet radio.SchDoc
size A4
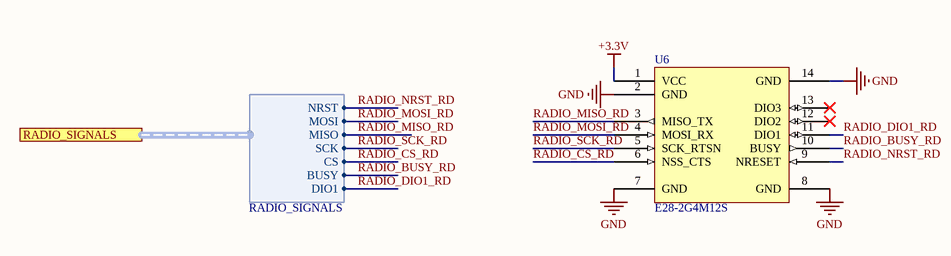
[diagram p6: radio.SchDoc]

### Parts
U6  E28-2G4M12S  [PE28(2G4M12S)]

### Ports
RADIO_SIGNALS (harness RADIO_SIGNALS)

### Harnesses
RADIO_SIGNALS: CS, SCK, MISO, MOSI, NRST, BUSY, DIO1

### Nets
+3.3V: U6.1(VCC)
GND: U6.2(GND) U6.7(GND) U6.8(GND) U6.14(GND)
RADIO_BUSY_RD: U6.10(BUSY) ; port RADIO_SIGNALS.BUSY  [project net RADIO_BUSY]
RADIO_CS_RD: U6.6(NSS_CTS) ; port RADIO_SIGNALS.CS  [project net RADIO_CS]
RADIO_DIO1_RD: U6.11(DIO1) ; port RADIO_SIGNALS.DIO1  [project net RADIO_DIO1]
RADIO_MISO_RD: U6.3(MISO_TX) ; port RADIO_SIGNALS.MISO  [project net RADIO_MISO]
RADIO_MOSI_RD: U6.4(MOSI_RX) ; port RADIO_SIGNALS.MOSI  [project net RADIO_MOSI]
RADIO_NRST_RD: U6.9(NRESET) ; port RADIO_SIGNALS.NRST  [project net RADIO_NRST]
RADIO_SCK_RD: U6.5(SCK_RTSN) ; port RADIO_SIGNALS.SCK  [project net RADIO_SCK]

Not connected (* = marked no-connect by the designer): U6 12(DIO2)* 13(DIO3)*

### Library data of the parts
U6 = E28-2G4M12S: 2.4GHz LoRa modules; Part Number: E28-2G4M12S

## Nets that join several sheets
+3.3V: power (5 pins), radio (U6.1)
GND: power (7 pins), radio (U6.2 U6.7 U6.8 U6.14)
JETSON_3V3: jetson-nano (C7.2 J3.17 R19.2), motor-driver (J4.14 J4.15), power (J2.5 R4.2), buffer (20 pins)
JETSON_GND: ui-pcb (TP1.1), jetson-nano (10 pins), motor-driver (J4.13), power (J2.1), buffer (16 pins)
BF_CS_CTRL_0: lowpass-filters (R8.2), buffer (U3.5)
BF_CS_CTRL_1: lowpass-filters (R9.2), buffer (U3.13)
BF_CS_CTRL_2: lowpass-filters (R10.2), buffer (U3.12)
BF_CS_CTRL_3: lowpass-filters (R11.2), buffer (U3.11)
BF_CS_CTRL_4: lowpass-filters (R12.2), buffer (U4.12)
BF_CTRL_EN: lowpass-filters (R18.2), buffer (U2.13)
BF_MISO: lowpass-filters (R7.2), buffer (U2.10)
BF_MOSI: lowpass-filters (R6.2), buffer (U2.12)
BF_MUX_SEL_0: lowpass-filters (R13.2), buffer (U4.13)
BF_MUX_SEL_1: lowpass-filters (R14.2), buffer (U4.11)
BF_RESET: lowpass-filters (R16.2), buffer (U4.5)
BF_RX: lowpass-filters (R15.2), buffer (U5.10)
BF_SCK: lowpass-filters (R5.2), buffer (U2.11)
BF_TX: lowpass-filters (R17.2), buffer (U5.11)
CS_CTRL_0: lowpass-filters (R8.1), motor-driver (J4.2 TP7.1)
CS_CTRL_1: lowpass-filters (R9.1), motor-driver (J4.3 TP8.1)
CS_CTRL_2: lowpass-filters (R10.1), motor-driver (J4.4 TP9.1)
CS_CTRL_3: lowpass-filters (R11.1), motor-driver (J4.5 TP10.1)
CS_CTRL_4: lowpass-filters (R12.1), motor-driver (J4.6 TP11.1)
CTRL_EN: lowpass-filters (R18.1), motor-driver (J4.11 TP16.1)
LF_MISO_SRC: lowpass-filters (R7.1), motor-driver (J4.9 TP14.1)
LF_MOSI_DST: lowpass-filters (R6.1), motor-driver (J4.10 TP15.1)
LF_MUX_SEL_0_DST: lowpass-filters (R13.1), motor-driver (J4.1)
LF_MUX_SEL_1_DST: lowpass-filters (R14.1), motor-driver (J4.7 TP12.1)
LF_RST_DST: lowpass-filters (R16.1), motor-driver (J4.12 TP17.1)
LF_RX_PWR: lowpass-filters (R15.1), power (J2.2 TP2.1)
LF_SCK_DST: lowpass-filters (R5.1), motor-driver (J4.8 TP13.1)
LF_TX_PWR: lowpass-filters (R17.1), power (J2.3 TP3.1)
RADIO_BUSY: jetson-nano (J3.40), radio (U6.10)
RADIO_CS: jetson-nano (J3.16), radio (U6.6)
RADIO_DIO1: jetson-nano (J3.07), radio (U6.11)
RADIO_MISO: jetson-nano (J3.22), radio (U6.3)
RADIO_MOSI: jetson-nano (J3.37), radio (U6.4)
RADIO_NRST: jetson-nano (J3.38), radio (U6.9)
RADIO_SCK: jetson-nano (J3.13), radio (U6.5)
SRC_CS_CTRL_0: jetson-nano (J3.24), buffer (U3.10)
SRC_CS_CTRL_1: jetson-nano (J3.26), buffer (U3.2)
SRC_CS_CTRL_2: jetson-nano (J3.29), buffer (U3.3)
SRC_CS_CTRL_3: jetson-nano (J3.31), buffer (U3.4)
SRC_CS_CTRL_4: jetson-nano (J3.33), buffer (U4.3)
SRC_CTRL_EN: jetson-nano (J3.15), buffer (U2.2)
SRC_MD_MISO: jetson-nano (J3.21), buffer (U2.5)
SRC_MD_MOSI: jetson-nano (J3.19), buffer (U2.3)
SRC_MD_RESET: jetson-nano (J3.32), buffer (U4.10)
SRC_MD_SCK: jetson-nano (J3.23), buffer (U2.4)
SRC_MUX_SEL_0: jetson-nano (J3.36), buffer (U4.2)
SRC_MUX_SEL_1: jetson-nano (J3.35), buffer (U4.4)
SRC_RX: jetson-nano (J3.10), buffer (U5.5)
SRC_TX: jetson-nano (J3.08), buffer (U5.4)

## Assembly variants
No FL: all parts fitted
No FL_PD_R: not fitted R7 R9 R11 R13 R15 R17 R18 R19 TP1 TP2 TP3 TP4 TP5 TP6 TP7 TP8 TP9 TP10 TP11 TP12 TP13 TP14 TP15 TP16 TP17 TP18